# Altium schematic sheet [07] - USB.SchDoc: DOCUMENT TITLE
size A4; Organization: Bjørn T. Brodtkorb; Address1: Frode Rinnans veg 161; Address2: 7050 Trondheim; DocumentNumber: 6598; Revision: 1.0; SheetNumber: 1; SheetTotal: 1
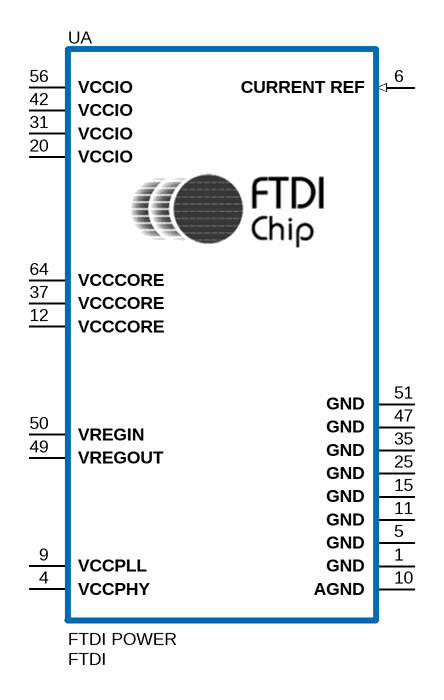
[diagram p0: [07] - USB.SchDoc]

## Parts
U  FTDI  [FT2232HQ]  (part A of 2)

## Nets

Not connected (* = marked no-connect by the designer): U 1(GND) 4(VCCPHY) 5(GND) 6(CURRENT_REF) 9(VCCPLL) 10(AGND) 11(GND) 12(VCCCORE) 15(GND) 20(VCCIO) 25(GND) 31(VCCIO) 35(GND) 37(VCCCORE) 42(VCCIO) 47(GND) 49(VREGOUT) 50(VREGIN) 51(GND) 56(VCCIO) 64(VCCCORE)

## Notes on the sheet
- Title
- Size:
- A4
- Number:
- Revision:
- Date:
- File:
- Time:
- Sheet
- of
- (in symbol FT2232HQ, part A) FTDI POWER

## Library data of the parts
U = FT2232HQ: USB to multipurpose UART / FIFO; Supplier Part Number 1: 768-1346-ND; Supplier 1: Digi-Key